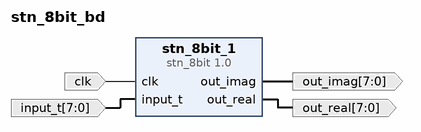
[diagram p0: block diagram of the top level]
# Vivado block design stn_8bit_bd, xc7z020clg484-1, Vivado 2021.1
create_bd_design stn_8bit_bd

create_bd_port -dir I -type clk clk
create_bd_port -dir I -from 7 -to 0 -type data input_t
create_bd_port -dir O -from 7 -to 0 -type data out_imag
create_bd_port -dir O -from 7 -to 0 -type data out_real

create_bd_cell -type ip -vlnv User_Company:SysGen:stn_8bit:1.0 stn_8bit_1

# ---- connections ----

connect_bd_net [get_bd_ports clk] [get_bd_pins stn_8bit_1/clk]
connect_bd_net [get_bd_ports input_t] [get_bd_pins stn_8bit_1/input_t]
connect_bd_net [get_bd_pins stn_8bit_1/out_imag] [get_bd_ports out_imag]
connect_bd_net [get_bd_pins stn_8bit_1/out_real] [get_bd_ports out_real]

validate_bd_design
save_bd_design
